# Altium schematic sheet EVK-NORA-B2_SCHEM_0006_USBhub_FTDI.SchDoc
size A3; Date: 7/24/2020; CompanyName: U-blox; DrawnBy: EMOO; Engineer: EMOO; Organization: U-blox; Address1: 3950 Fairview Industrial Dr SE #100; Address2: Salem, OR 97302; SheetNumber: 6; SheetTotal: 6; SheetSize: B; SheetTitle: Interface MCU
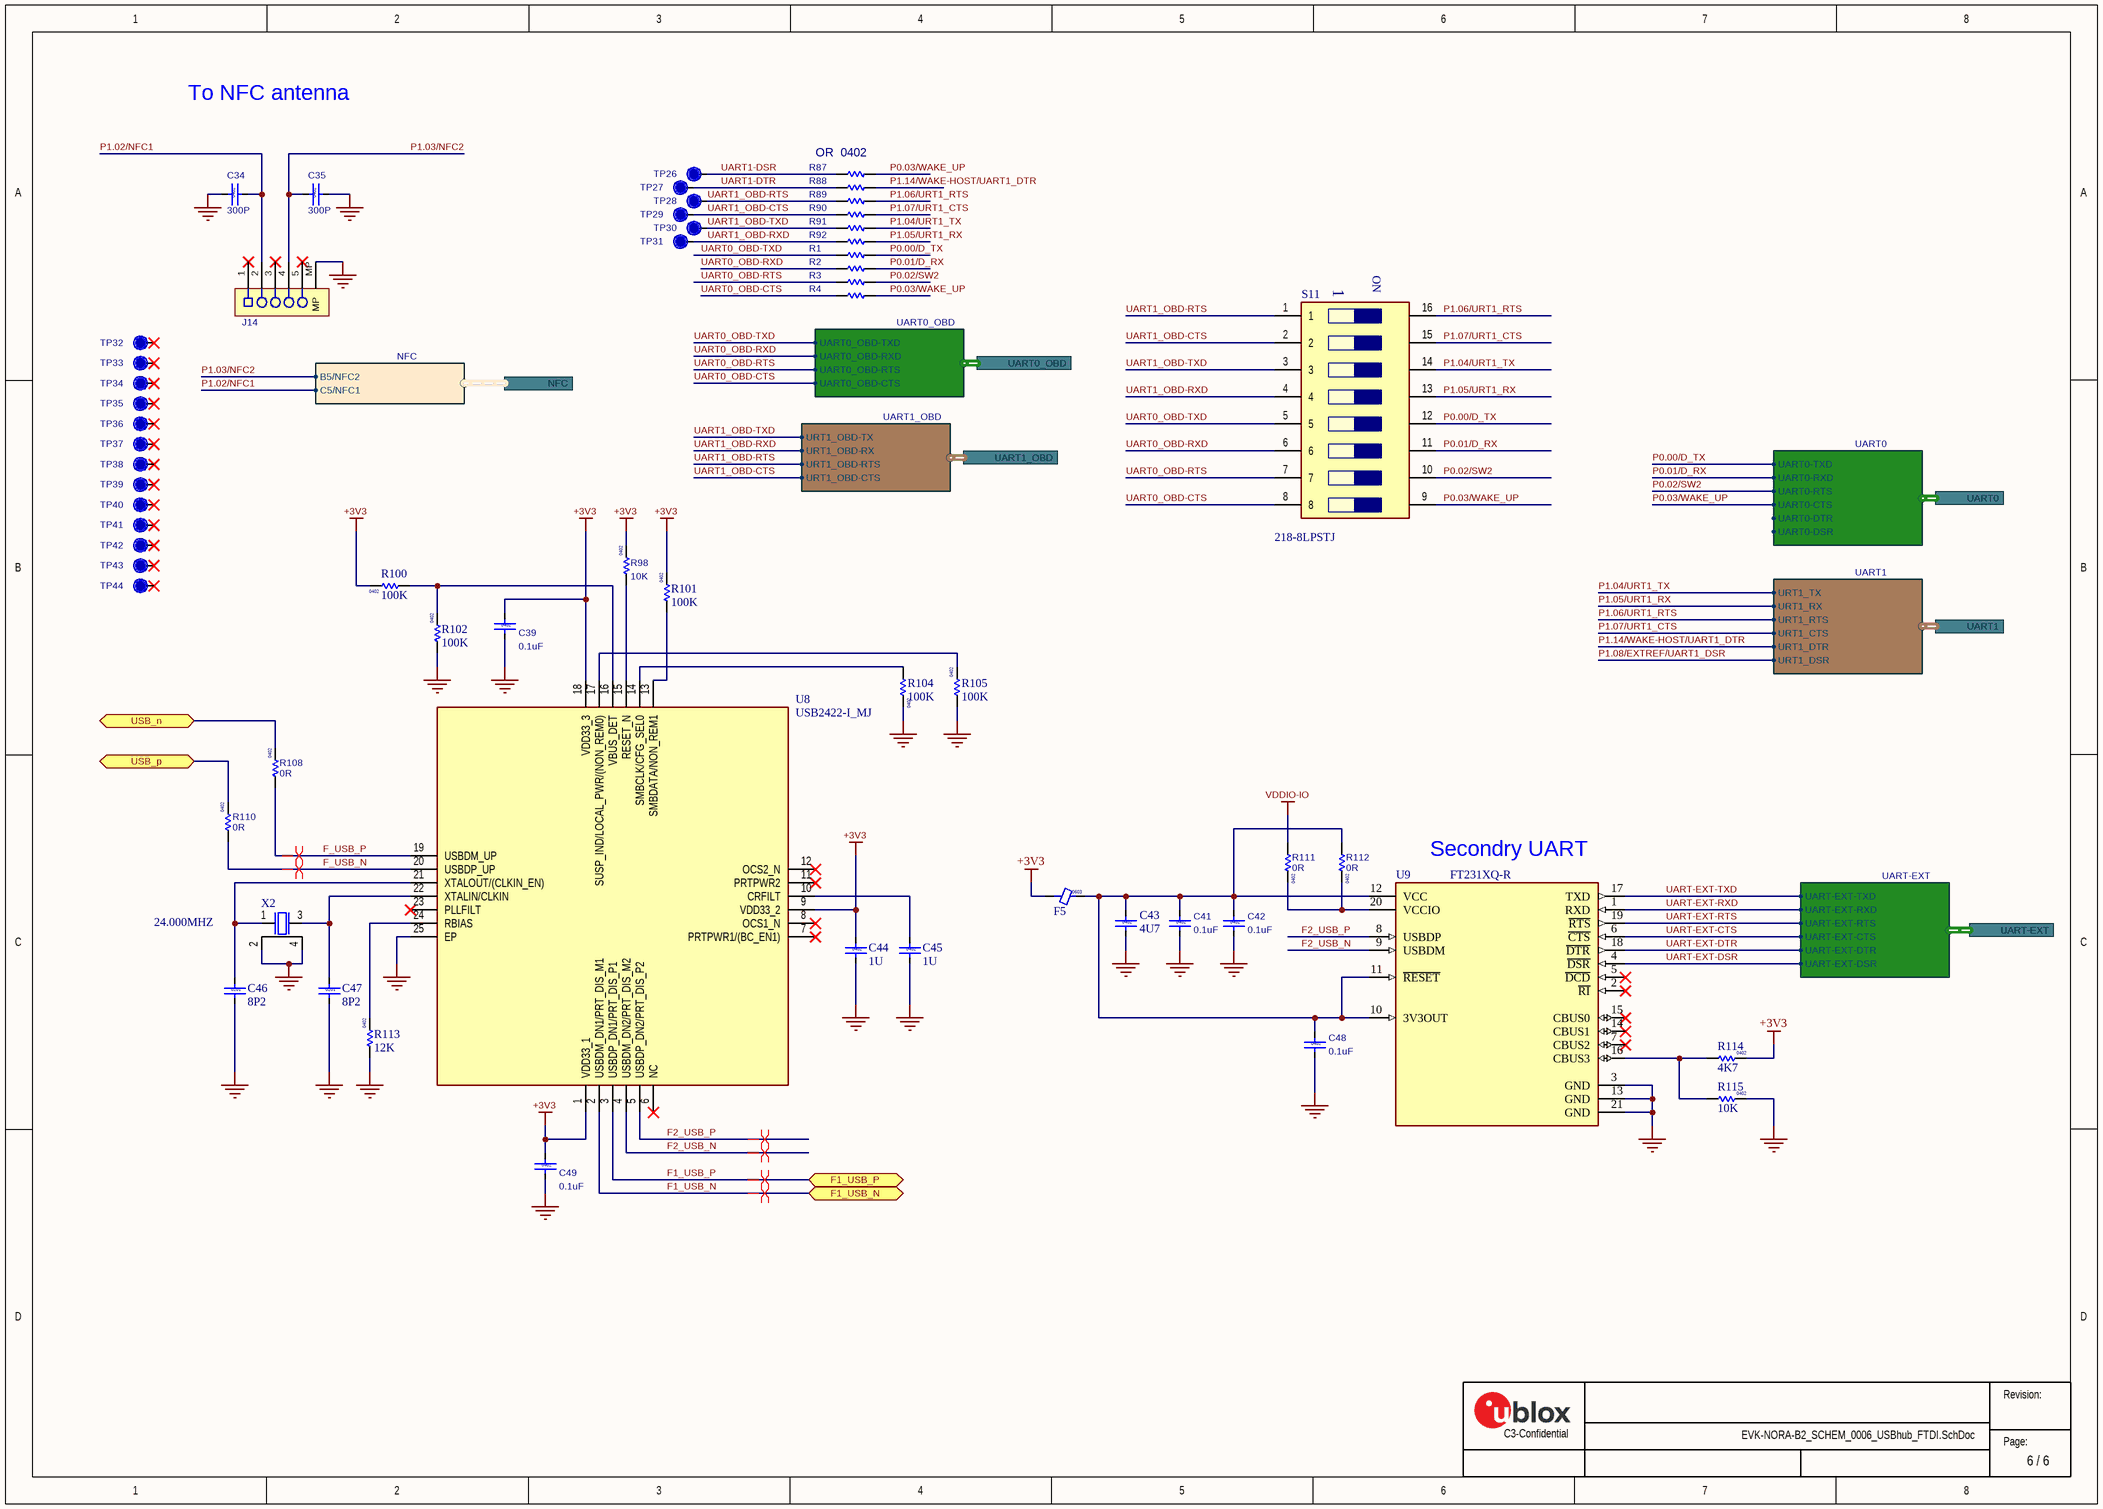
[diagram p0: EVK-NORA-B2_SCHEM_0006_USBhub_FTDI.SchDoc]

## Parts
C34  value 300P  Size: 0402  [Cap 0402 HD]
C35  value 300P  Size: 0402  [Cap 0402 HD]
C39  value 0.1uF  Size: 0402  [Cap 0402 HD]  (hidden comment: 120-000160.1uF)
C41  value 0.1uF  Size: 0402  [Cap 0402 HD]  (hidden comment: 120-000160.1uF)
C42  value 0.1uF  Size: 0402  [Cap 0402 HD]  (hidden comment: 120-000160.1uF)
C43  value 4U7  Size: 0402  [Cap 0402 HD]
C44  value 1U  Size: 0402  [Cap 0402 HD]
C45  value 1U  Size: 0402  [Cap 0402 HD]
C46  value 8P2  Size: 0201  [Cap 0201 HD]
C47  value 8P2  Size: 0201  [Cap 0201 HD]
C48  value 0.1uF  Size: 0402  [Cap 0402 HD]  (hidden comment: 120-000160.1uF)
C49  value 0.1uF  Size: 0402  [Cap 0402 HD]  (hidden comment: 120-000160.1uF)
F5  Size: 0603  [IND_0603_1750Lx950Wx1050H_600x800Pad_800G_FLX]
J14  UBXH04-0000798  [AVX/Kyocera - 046284005001846]  (value not drawn)
R1  (no value)  [RES 0402 HD]
R2  (no value)  [RES 0402 HD]
R3  (no value)  [RES 0402 HD]
R4  (no value)  [RES 0402 HD]
R87  (no value)  [RES 0402 HD]
R88  (no value)  [RES 0402 HD]
R89  (no value)  [RES 0402 HD]
R90  (no value)  [RES 0402 HD]
R91  (no value)  [RES 0402 HD]
R92  (no value)  [RES 0402 HD]
R98  value 10K  Size: 0402  [RES 0402 HD]
R100  value 100K  Size: 0402  [RES 0402 HD]
R101  value 100K  Size: 0402  [RES 0402 HD]
R102  value 100K  Size: 0402  [RES 0402 HD]
R104  value 100K  Size: 0402  [RES 0402 HD]
R105  value 100K  Size: 0402  [RES 0402 HD]
R108  value 0R  Size: 0402  [RES 0402 HD]
R110  value 0R  Size: 0402  [RES 0402 HD]
R111  value 0R  Size: 0402  [RES 0402 HD]
R112  value 0R  Size: 0402  [RES 0402 HD]
R113  value 12K  Size: 0402  [RES_0402_1100Lx600Wx400H_500x600Pad_400G_FLX]
R114  value 4K7  Size: 0402  [RES_0402_1100Lx600Wx400H_500x600Pad_400G_FLX]
R115  value 10K  Size: 0402  [RES_0402_1100Lx600Wx400H_500x600Pad_400G_FLX]
S11  218-8LPSTJ  [2188LPSTJ]
TP26  TP  [TP10R]  (value not drawn)  (no BOM)
TP27  TP  [TP10R]  (value not drawn)  (no BOM)
TP28  TP  [TP10R]  (value not drawn)  (no BOM)
TP29  TP  [TP10R]  (value not drawn)  (no BOM)
TP30  TP  [TP10R]  (value not drawn)  (no BOM)
TP31  TP  [TP10R]  (value not drawn)  (no BOM)
TP32  TP  [TP10R]  (value not drawn)  (no BOM)
TP33  TP  [TP10R]  (value not drawn)  (no BOM)
TP34  TP  [TP10R]  (value not drawn)  (no BOM)
TP35  TP  [TP10R]  (value not drawn)  (no BOM)
TP36  TP  [TP10R]  (value not drawn)  (no BOM)
TP37  TP  [TP10R]  (value not drawn)  (no BOM)
TP38  TP  [TP10R]  (value not drawn)  (no BOM)
TP39  TP  [TP10R]  (value not drawn)  (no BOM)
TP40  TP  [TP10R]  (value not drawn)  (no BOM)
TP41  TP  [TP10R]  (value not drawn)  (no BOM)
TP42  TP  [TP10R]  (value not drawn)  (no BOM)
TP43  TP  [TP10R]  (value not drawn)  (no BOM)
TP44  TP  [TP10R]  (value not drawn)  (no BOM)
U8  USB2422-I_MJ  [QFN50P400X400X100-25N-D]
U9  FT231XQ-R  [QFN_5x5_FT231XQ]
X2  value 24.000MHZ  [XTAL_2016_HD]

## Ports
F1_USB_N (bidir), F1_USB_P (bidir), NFC (harness NFC), UART0 (harness UART0), UART0_OBD (harness UART0_OBD), UART1 (harness UART1), UART1_OBD (harness UART1_OBD), UART-EXT (harness UART-EXT), USB_n (bidir), USB_p (bidir)

## Harnesses
UART-EXT: UART-EXT-TXD, UART-EXT-RXD, UART-EXT-RTS, UART-EXT-CTS, UART-EXT-DTR, UART-EXT-DSR
UART1: URT1_RTS, URT1_CTS, URT1_TX, URT1_RX, URT1_DTR, URT1_DSR
NFC: B5/NFC2, C5/NFC1
UART0: UART0-TXD, UART0-RXD, UART0-RTS, UART0-CTS, UART0-DTR, UART0-DSR
UART1_OBD: URT1_OBD-RTS, URT1_OBD-CTS, URT1_OBD-TX, URT1_OBD-RX
UART0_OBD: UART0_OBD-TXD, UART0_OBD-RXD, UART0_OBD-RTS, UART0_OBD-CTS

## Nets
+3V3: C39.1 C44.1 C49.1 F5.1 R98.2 R100.2 R101.2 R114.2 U8.1(VDD33_1) U8.9(VDD33_2) U8.18(VDD33_3)
GND: C34.1 C35.2 C39.2 C41.2 C42.2 C43.2 C44.2 C45.2 C46.2 C47.2 C48.2 C49.2 J14.MP R102.1 R104.2 R105.1 R113.1 R115.2 U8.25(EP) U9.3(GND) U9.13(GND) U9.21(GND) X2.2 X2.4
VDDIO-IO: R111.1
F1_USB_N: U8.2(USBDM_DN1/PRT_DIS_M1) ; port F1_USB_N
F1_USB_P: U8.3(USBDP_DN1/PRT_DIS_P1) ; port F1_USB_P
F2_USB_N: U8.4(USBDM_DN2/PRT_DIS_M2) U9.9(USBDM)
F2_USB_P: U8.5(USBDP_DN2/PRT_DIS_P2) U9.8(USBDP)
F_USB_N: R110.1 U8.20(USBDP_UP)
F_USB_P: R108.1 U8.19(USBDM_UP)
P0.00/D_TX: R1.2 S11.12 ; port UART0.UART0-TXD
P0.01/D_RX: R2.2 S11.11 ; port UART0.UART0-RXD
P0.02/SW2: R3.2 S11.10 ; port UART0.UART0-RTS
P0.03/WAKE_UP: R4.2 R87.2 S11.9 ; port UART0.UART0-CTS
P1.02/NFC1: C34.2 J14.2 ; port NFC.C5/NFC1
P1.03/NFC2: C35.1 J14.4 ; port NFC.B5/NFC2
P1.04/URT1_TX: R91.2 S11.14 ; port UART1.URT1_TX
P1.05/URT1_RX: R92.2 S11.13 ; port UART1.URT1_RX
P1.06/URT1_RTS: R89.2 S11.16 ; port UART1.URT1_RTS
P1.07/URT1_CTS: R90.2 S11.15 ; port UART1.URT1_CTS
P1.08/EXTREF/UART1_DSR: port UART1.URT1_DSR
P1.14/WAKE-HOST/UART1_DTR: R88.2 ; port UART1.URT1_DTR
UART0_OBD-CTS: R4.1 S11.8 ; port UART0_OBD.UART0_OBD-CTS
UART0_OBD-RTS: R3.1 S11.7 ; port UART0_OBD.UART0_OBD-RTS
UART0_OBD-RXD: R2.1 S11.6 ; port UART0_OBD.UART0_OBD-RXD
UART0_OBD-TXD: R1.1 S11.5 ; port UART0_OBD.UART0_OBD-TXD
UART1-DSR: R87.1 TP27.1
UART1-DTR: R88.1 TP26.1
UART1_OBD-CTS: R90.1 S11.2 TP29.1 ; port UART1_OBD.URT1_OBD-CTS
UART1_OBD-RTS: R89.1 S11.1 TP28.1 ; port UART1_OBD.URT1_OBD-RTS
UART1_OBD-RXD: R92.1 S11.4 TP31.1 ; port UART1_OBD.URT1_OBD-RX
UART1_OBD-TXD: R91.1 S11.3 TP30.1 ; port UART1_OBD.URT1_OBD-TX
UART-EXT-CTS: U9.6(~{CTS}) ; port UART-EXT.UART-EXT-CTS
UART-EXT-DSR: U9.4(~{DSR}) ; port UART-EXT.UART-EXT-DSR
UART-EXT-DTR: U9.18(~{DTR}) ; port UART-EXT.UART-EXT-DTR
UART-EXT-RTS: U9.19(~{RTS}) ; port UART-EXT.UART-EXT-RTS
UART-EXT-RXD: U9.1(RXD) ; port UART-EXT.UART-EXT-RXD
UART-EXT-TXD: U9.17(TXD) ; port UART-EXT.UART-EXT-TXD
USB_n: R108.2 ; port USB_n
USB_p: R110.2 ; port USB_p
NetC41_1: C41.1 C42.1 C43.1 C48.1 F5.2 R112.1 U9.10(3V3OUT) U9.11(~{RESET}) U9.12(VCC)
NetC45_1: C45.1 U8.10(CRFILT)
NetC46_1: C46.1 U8.21(XTALOUT/(CLKIN_EN)) X2.1
NetC47_1: C47.1 U8.22(XTALIN/CLKIN) X2.3
NetR98_1: R98.1 U8.15(RESET_N)
NetR100_1: R100.1 R102.2 U8.16(VBUS_DET)
NetR101_1: R101.1 U8.13(SMBDATA/NON_REM1)
NetR104_1: R104.1 U8.14(SMBCLK/CFG_SEL0)
NetR105_2: R105.2 U8.17(SUSP_IND/LOCAL_PWR/(NON_REM0))
NetR111_2: R111.2 R112.2 U9.20(VCCIO)
NetR113_2: R113.2 U8.24(RBIAS)
NetR114_1: R114.1 R115.1 U9.16(CBUS3)

Not connected (* = marked no-connect by the designer): J14 1* 3* 5*; TP32 1*; TP33 1*; TP34 1*; TP35 1*; TP36 1*; TP37 1*; TP38 1*; TP39 1*; TP40 1*; TP41 1*; TP42 1*; TP43 1*; TP44 1*; U8 6(NC)* 7(PRTPWR1/(BC_EN1))* 8(OCS1_N)* 11(PRTPWR2)* 12(OCS2_N)* 23(PLLFILT)*; U9 2(~{RI})* 5(~{DCD})* 7(CBUS2)* 14(CBUS1)* 15(CBUS0)*

## Layout directives
differential pair: F1_USB_N, F1_USB_P, F2_USB_N, F2_USB_P, F_USB_N, F_USB_P

## Notes on the sheet
- To NFC antenna
- (near R87) OR  0402
- (near U9) Secondry UART
- Revision:
- C3-Confidential
- Page:
- (in symbol 218-8LPSTJ) ON

## Library data of the parts
C34 C35 = UBXH01-0000594: CAP CER C0G 0402 300P 50V; Manufacturer: Murata Manufacturing Company, Ltd.; Manufacturer P/N: GRM1555C1H301JA01D; Editor: eric.moog; Env: ROHS; Permitted Use: Volume Products; Perferred: PREF; Mfg P/N Status: Active; Mfg P/N Split: 100; Mfg P/N Released: No; Part Number: UBXH01-0000594; Max Voltage: 50V; Min Operating Temp: -55°C; Max Operating Temp: 125°C; Part Type: Capacitor; UBX Wiki: https://wiki.u-blox.com/bin/view/Operations/PartDetails?index=38856; RefDes: C
C39 C41 C42 C48 C49 = 120-00016: Cap, Ceramic 0.1uF 10V 10% X5R 0402; Part Name: CAP CER 0.1UF 10V 10% X5R 0402; Part_Type: Ceramic Capacitor; Manufacturer: Murata Electronics North America; Manufacturer P/N: GRM155R61A104KA01J; Item_Phase: Production; Component Mounting Type: SMT; Tolerance: +/- 10%; Use in new designs: Yes; Part Number: 120-00016; Revision: 0A; Supplier 1: Digi-Key; Supplier Part Number 1: 490-6297-1-ND; Manufacturer 2: Yageo; Manufacturer P/N 2: CC0402KRX5R6BB104; Supplier 2: Digi-Key; Supplier Part Number 2: 311-1336-1-ND; Arena Link: https://app.bom.com/a/GYHPV2L2L43KRMBK?v=spec.summary; Height: 0.55mm; Pins: 2; Temperature Coefficient: X5R; Voltage: 10V
C43 = UBXH01-0000243: CAP CER X5R 0402 4U7 20% 10V; Manufacturer: Murata Manufacturing Company, Ltd.; Manufacturer P/N: GRM155R61A475MEAA; Editor: martin.pilik; Released by: fabrice.bret-dibat; Env: GREEN; Permitted Use: Volume Products; Perferred: PREF; Mfg P/N Status: Active; Mfg P/N Split: 100; Mfg P/N Released: Yes; Part Number: UBXH01-0000243; Tolerance: 20%; Max Voltage: 10V; Min Operating Temp: -40°C; Max Operating Temp: 85°C; Part Type: Capacitor; Release Data: 2021-05-10 12:57:47.325652; UBX Wiki: https://wiki.u-blox.com/bin/view/Operations/PartDetails?index=24303; RefDes: C; Mfg P/N Datasheet: https://wiki.u-blox.com/bin/view/Generic/Docs/DocumentSummary?index=24302
C44 C45 = UBXH01-0000248: CAP CER X5R 0402 1U 10% 10V; Manufacturer: Murata Manufacturing Company, Ltd.; Manufacturer P/N: GRM155R61C105KA12; Editor: michael.hein; Released by: igor.shevchenko; Env: ROHS; Permitted Use: Volume Products; Perferred: PREF; Mfg P/N Status: Active; Mfg P/N Split: 100; Mfg P/N Released: Yes; Part Number: UBXH01-0000248; Tolerance: 10%; Max Voltage: 10V; Min Operating Temp: -40°C; Max Operating Temp: 85°C; Part Type: Capacitor; Release Data: 2016-03-16T11:26:35; UBX Wiki: https://wiki.u-blox.com/bin/view/Operations/PartDetails?index=24378; RefDes: C; Mfg P/N Datasheet: https://wiki.u-blox.com/bin/view/Generic/Docs/DocumentSummary?index=29581; Manufacturer 2: TDK Corporation; Manufacturer P/N 2: C1005X5R1E105K050BC; Mfg P/N Status 2: Active; Mfg P/N Split 2: 0; Mfg P/N Released 2: Yes; Mfg P/N Datasheet 2: https://wiki.u-blox.com/bin/view/Generic/Docs/DocumentSummary?index=28058; Manufacturer 3: Samsung Electro-Mechanics; Manufacturer P/N 3: CL05A105KA5NQNC; Mfg P/N Status 3: Active; Mfg P/N Split 3: 0; Mfg P/N Released 3: Yes; Mfg P/N Datasheet 3: https://wiki.u-blox.com/bin/view/Generic/Docs/DocumentSummary?index=28056
C46 C47 = UBXH01-0013002: CAP CER C0G 0201 8P2 +/-0.5P 25V; Manufacturer: Murata Manufacturing Company, Ltd.; Manufacturer P/N: GRM0335C1E8R2DA01; Editor: roland.rust; Env: ROHS; Permitted Use: Volume Products; Perferred: PREF; Mfg P/N Status: Active; Mfg P/N Split: 100; Mfg P/N Released: Yes; Part Number: UBXH01-0013002; Tolerance: +/-0.5P; Max Voltage: 25V; Part Type: Capacitor; Released by: roland.rust; Release Data: 2009-03-23T10:34:14; UBX Wiki: https://wiki.u-blox.com/bin/view/Operations/PartDetails?index=5090; RefDes: C; Manufacturer 2: Murata Manufacturing Company, Ltd.; Manufacturer P/N 2: GRM0335C1E8R2D; Mfg P/N Status 2: Active; Mfg P/N Split 2: 0; Mfg P/N Released 2: Obsolete
F5 = UBXH08-0000001: FERRITE BEAD 0603 600 OHM AT 100MHZ 600OHM 500mA; Manufacturer: TDK Corporation; Manufacturer P/N: MMZ1608B601C; Editor: daniel.hurni; Released by: martin.frauchiger; Env: ROHS; Permitted Use: Support Products; Perferred: PREF; Mfg P/N Status: Active; Mfg P/N Split: 100; Mfg P/N Released: Yes; Part Number: UBXH08-0000001; Value: 600OHM; Max Current: 500mA; Min Operating Temp: -40°C; Max Operating Temp: 125°C; Part Type: Ferrite; Release Data: 2009-12-02T10:18:36; UBX Wiki: https://wiki.u-blox.com/bin/view/Operations/PartDetails?index=7960; RefDes: FB; Mfg P/N Datasheet: https://wiki.u-blox.com/bin/view/Generic/Docs/DocumentSummary?index=7941
J14 = UBXH04-0000798: 0.50MM PITCH SMD RA FFC FPC CONN 5 -PIN 50V 400mA; Manufacturer P/N: 046284005001846; Part Name: CON FFC/FPC 0.50mm 5Pos R/A; Part_Type: Connector; Manufacturer 1: KYOCERA AVX; Manufacturer: AVX; Item_Phase: Preliminary; Component Mounting Type: SMT; Keyed: No; Pin Pitch: 0.5mm; Rows: 1; Use in new designs: Yes; Value: 046284005001846; Editor: eric.moog; Env: ROHS; Permitted Use: Support Products; Perferred: PREF; Mfg P/N Status: Active; Mfg P/N Split: 100; Part Number: UBXH04-0000798; Color: White; Connector Type: FPC; Height: 1.3mm; Length: 4.05mm; Locking: No; Pins: 5; Voltage: 50V; Width: 4.4mm; Manufacturer Part Number 1: 046284005001846; Max Voltage: 50V; Max Current: 400mA; Min Operating Temp: -40°C; Max Operating Temp: 85°C; Part Type: Connector; UBX Wiki: https://wiki.u-blox.com/bin/view/Operations/PartDetails?index=38822; RefDes: J; Mfg P/N Released: No; Mfg P/N Datasheet: https://wiki.u-blox.com/bin/view/Generic/Docs/DocumentSummary?index=38862
R1-R4 R87-R92 R108 R110 = UBXH18-0003002: RES THICK FILM CHIP 0402 0R 0 100mW; Manufacturer: KOA; Manufacturer P/N: RK73Z1ETTD; Tolerance: 0; Editor: charlotte.biber; Released by: peter.mueller; Env: ROHS; Permitted Use: Volume Products; Perferred: PREF; Mfg P/N Status: NRND; Mfg P/N Split: 100; Mfg P/N Released: Yes; Part Number: UBXH18-0003002; Max Power: 100mW; Part Type: Resistor; Release Data: 2012-06-05 09:49:55.978616; UBX Wiki: https://wiki.u-blox.com/bin/view/Operations/PartDetails?index=6611; RefDes: R; Manufacturer 2: YAGEO; Manufacturer P/N 2: 2322_705_91001_L; Mfg P/N Status 2: NRND; Mfg P/N Split 2: 0; Mfg P/N Released 2: Yes
  R1-R4 R87-R92: Value: 0R; Size: 0402
R98 = UBXH18-0000065: RES THICK FILM CHIP 0402 10K 1% 63mW; Manufacturer: KOA; Manufacturer P/N: RK73H1ETTP1002F; Editor: erian.bezhani; Released by: massimo.vlacci; Env: ROHS; Permitted Use: Volume Products; Perferred: PREF; Mfg P/N Status: Active; Mfg P/N Split: 100; Mfg P/N Released: Yes; Part Number: UBXH18-0000065; Tolerance: 1%; Max Power: 63mW; Part Type: Resistor; Release Data: 2012-06-08 18:02:21.521517; UBX Wiki: https://wiki.u-blox.com/bin/view/Operations/PartDetails?index=16837; RefDes: R; Mfg P/N Datasheet: https://wiki.u-blox.com/bin/view/Generic/Docs/DocumentSummary?index=8222
R100-R102 R104 R105 = UBXH18-0000005: RES THICK FILM CHIP 0402 100K 1% 63mW; Manufacturer: KOA; Manufacturer P/N: RK73H1ETTP1003F; Editor: dario.antonaz; Released by: sandro.sestan; Env: ROHS; Permitted Use: Volume Products; Mfg P/N Status: Active; Mfg P/N Split: 100; Mfg P/N Released: Yes; Part Number: UBXH18-0000005; Tolerance: 1%; Max Power: 63mW; Part Type: Resistor; Release Data: 2009-11-30T11:05:22; UBX Wiki: https://wiki.u-blox.com/bin/view/Operations/PartDetails?index=8114; Perferred: N/A; RefDes: R; Mfg P/N Datasheet: https://wiki.u-blox.com/bin/view/Generic/Docs/DocumentSummary?index=8222; Manufacturer 2: ROHM; Manufacturer P/N 2: MCR01MZPF1003; Mfg P/N Status 2: Obsolete; Mfg P/N Split 2: 0; Mfg P/N Released 2: Yes; Mfg P/N Datasheet 2: https://wiki.u-blox.com/bin/view/Generic/Docs/DocumentSummary?index=8186
R111 R112 = UBXH18-0003002: RES THICK FILM CHIP 0402 0R 0 100mW; Manufacturer: KOA; Manufacturer P/N: RK73Z1ETTP; Tolerance: 0; Editor: charlotte.biber; Released by: peter.mueller; Env: ROHS; Permitted Use: Volume Products; Perferred: PREF; Mfg P/N Status: NRND; Mfg P/N Split: 100; Mfg P/N Released: Yes; Part Number: UBXH18-0003002; Max Power: 100mW; Part Type: Resistor; Release Data: 2012-06-05 09:49:55.978616; UBX Wiki: https://wiki.u-blox.com/bin/view/Operations/PartDetails?index=6611; RefDes: R; Manufacturer 2: YAGEO; Manufacturer P/N 2: 2322_705_91001_L; Mfg P/N Status 2: NRND; Mfg P/N Split 2: 0; Mfg P/N Released 2: Yes
R113 = UBXH18-0000133: RES THICK FILM CHIP 0402 12K 1% 62.5mW; Manufacturer: YAGEO; Manufacturer P/N: RT0402FRE0712KL; Editor: pierpaolo.arban; Released by: dario.antonaz; Env: ROHS; Permitted Use: Volume Products; Perferred: PREF; Mfg P/N Status: Active; Mfg P/N Split: 100; Mfg P/N Released: Yes; Part Number: UBXH18-0000133; Tolerance: 1%; Max Power: 62.5mW; Min Operating Temp: -55°C; Max Operating Temp: 155°C; Part Type: Resistor; Release Data: 2019-11-07T09:33:25; UBX Wiki: https://wiki.u-blox.com/bin/view/Operations/PartDetails?index=20511; RefDes: R; Mfg P/N Datasheet: https://wiki.u-blox.com/bin/view/Generic/Docs/DocumentSummary?index=19276
R114 = UBXH18-0008065: RES THICK FILM CHIP 0402 4K7 5% 100mW; Manufacturer: YAGEO; Manufacturer P/N: 2322_705_70472_L; Editor: martin.frauchiger; Env: ROHS; Permitted Use: Volume Products; Perferred: PREF; Mfg P/N Status: Obsolete; Mfg P/N Split: 100; Mfg P/N Released: Yes; Part Number: UBXH18-0008065; Tolerance: 5%; Max Power: 100mW; Part Type: Resistor; Released by: martin.frauchiger; Release Data: 2005-08-19T10:42:45; UBX Wiki: https://wiki.u-blox.com/bin/view/Operations/PartDetails?index=6969; RefDes: R; Manufacturer 2: KOA; Manufacturer P/N 2: RK73B1ETTD472J; Mfg P/N Status 2: NRND; Mfg P/N Split 2: 0; Mfg P/N Released 2: Yes
R115 = UBXH18-0008073: RES THICK FILM CHIP 0402 10K 5% 100mW; Manufacturer: KOA; Manufacturer P/N: RK73B1ETTD103J; Editor: martin.frauchiger; Env: ROHS; Permitted Use: Volume Products; Perferred: PREF; Mfg P/N Status: NRND; Mfg P/N Split: 100; Mfg P/N Released: Yes; Part Number: UBXH18-0008073; Tolerance: 5%; Max Power: 100mW; Part Type: Resistor; Released by: martin.frauchiger; Release Data: 2005-08-19T10:42:45; UBX Wiki: https://wiki.u-blox.com/bin/view/Operations/PartDetails?index=6981; RefDes: R; Manufacturer 2: YAGEO; Manufacturer P/N 2: RC0402JR-0710KL; Mfg P/N Status 2: Active; Mfg P/N Split 2: 0; Mfg P/N Released 2: No; Manufacturer 3: YAGEO; Manufacturer P/N 3: 2322_705_87103_L; Mfg P/N Status 3: Obsolete; Mfg P/N Split 3: 0; Mfg P/N Released 3: Yes
S11 = 218-8LPSTJ: Switch; Manufacturer_Name: CTS; Datasheet Link: https://www.ctscorp.com/wp-content/uploads/218.pdf; Height: 2.7mm; Manufacturer_Part_Number: 218-8LPSTJ; Mouser Part Number: 774-2188LPSTJ; Mouser Price/Stock: https://www.mouser.co.uk/ProductDetail/CTS-Electronic-Components/218-8LPSTJ?qs=hDoPxpGr7lfoBDyeqUpd9g%3D%3D; Arrow Part Number: 218-8LPSTJ; Arrow Price/Stock: https://www.arrow.com/en/products/218-8lpstj/cts
TP26-TP44 = TP10R: Testpoint, Round 1.0mm Dia; Added By: Jeremy D; Part Number: TP10R; Size: 1.0mm; Height: 0; DNP: DNP; Added Date: 2/1/2015; Checked By: Paul B; Checked Date: 2/5/2015
U8 = USB2422-I_MJ: Integrated Circuit; Manufacturer_Name: Microchip; Manufacturer_Part_Number: USB2422-I/MJ; Datasheet Link: https://datasheet.datasheetarchive.com/originals/distributors/DKDS-15/280029.pdf; Height: 1mm; Mouser Part Number: 579-USB2422-I/MJ; Mouser Price/Stock: https://www.mouser.co.uk/ProductDetail/Microchip-Technology-Atmel/USB2422-I-MJ?qs=eTPcRhULBzzm1uvzgv8YJg%3D%3D; Arrow Part Number: USB2422-I/MJ; Arrow Price/Stock: https://www.arrow.com/en/products/usb2422-imj/microchip-technology?region=nac
U9 = UBXH10-0000054: FTDI USB TO SERIAL FULL UART INTERFACE QFN20; Manufacturer: FTDI Future Technology Devices International; Editor: adam.johansson; Env: ROHS; Permitted Use: Support Products; Perferred: PREF; Mfg P/N Status: Active; Mfg P/N Split: 100; Mfg P/N Released: No; Part Number: UBXH10-0000054; Value: FT231XQ-R; Min Operating Temp: -40°C; Max Operating Temp: 85°C; Part Type: Interface; UBX Wiki: https://wiki.u-blox.com/bin/view/Operations/PartDetails?index=27258; RefDes: U; Manufacturer P/N: FT231XQ-R; Mfg P/N Datasheet: https://wiki.u-blox.com/bin/view/Generic/Docs/DocumentSummary?index=33707
X2 = UBXH21-0000066: CRYSTAL CL=8PF EPSON 2.0X1.6MM 24.000MHZ 30PPM; Manufacturer: Seiko Epson Corporation; Manufacturer P/N: Q22FA1280046700; Editor: adam.johansson; Released by: olof.viklund; Critical: Yes; Env: ROHS; Permitted Use: Volume Products; Perferred: PREF; Mfg P/N Status: Active; Mfg P/N Split: 100; Part Number: UBXH21-0000066; Tolerance: 30PPM; Min Operating Temp: -40°C; Max Operating Temp: 85°C; Part Type: Crystal; Release Data: 2015-11-11T10:35:48; UBX Wiki: https://wiki.u-blox.com/bin/view/Operations/PartDetails?index=21963; RefDes: Y; Mfg P/N Released: Yes; Mfg P/N Datasheet: https://wiki.u-blox.com/bin/view/Generic/Docs/DocumentSummary?index=23017; Manufacturer 2: Seiko Epson Corporation; Manufacturer P/N 2: Q22FA1280039800; Mfg P/N Status 2: Obsolete; Mfg P/N Split 2: 0; Mfg P/N Released 2: Obsolete; Mfg P/N Datasheet 2: https://wiki.u-blox.com/bin/view/Generic/Docs/DocumentSummary?index=21965